# EAGLE design pc_healthypi_move_nRF5340_v3.0 (EAGLE 9.6.2)
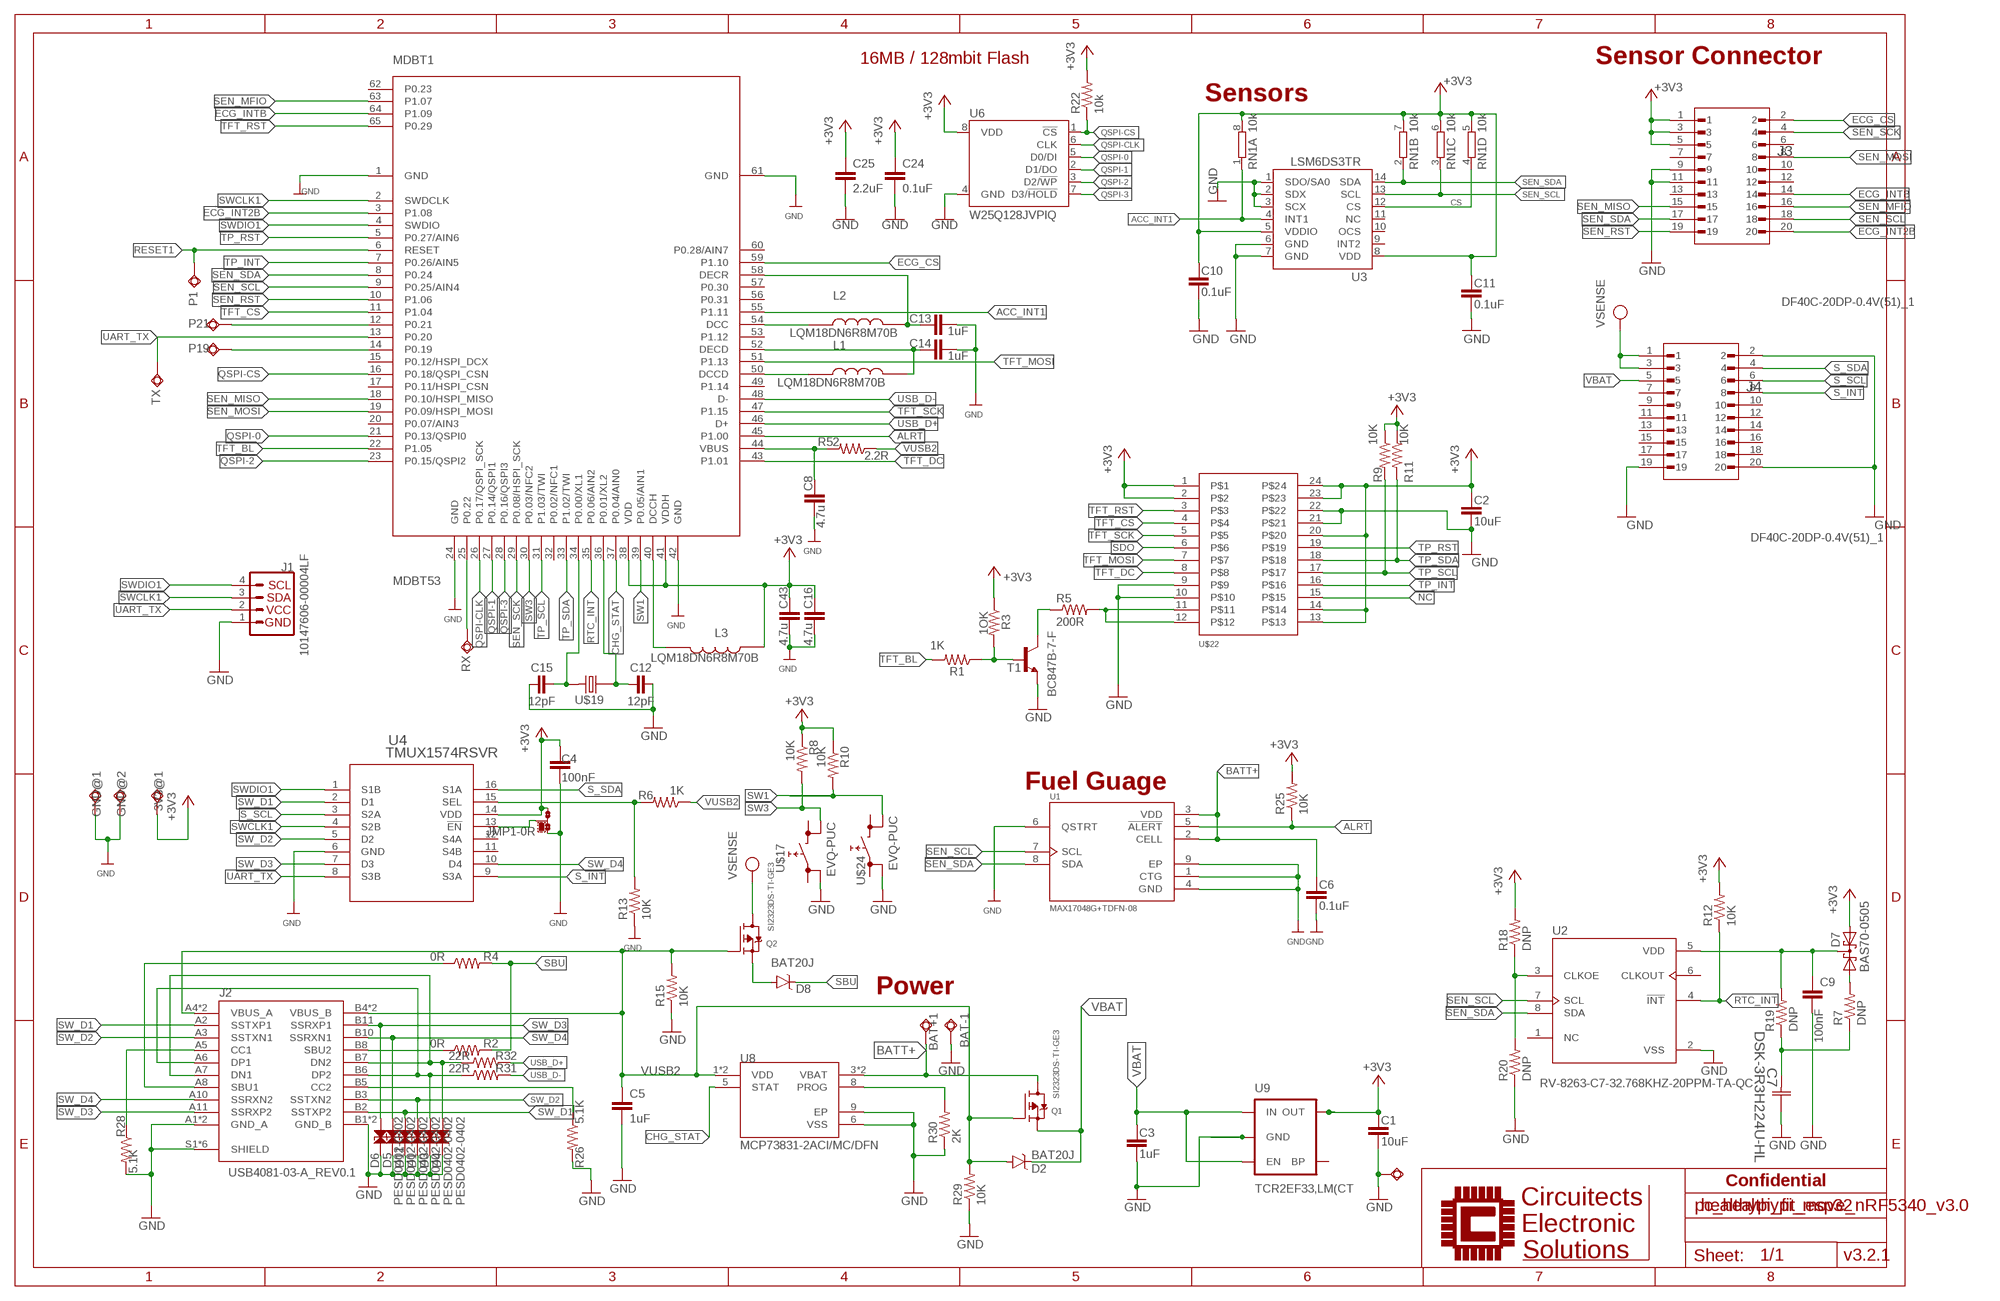
[diagram p0: schematic, sheet 1]

## Parts
3V3@1  TPSQTP13SQ  [TP13SQ]
BAT+1  TPSQTP13SQ  [TP13SQ]
BAT-1  TPSQTP13SQ  [TP13SQ]
C1  10uF  0.1UF-0603-100V-10%  [0603@1]
C2  10uF  0.1UF-0603-100V-10%  [0603@1]
C3  1uF  0.1UF-0402T-6.3V-10%-X7R  [0402-TIGHT]
C4  100nF  2.2UF-0402_TIGHT-10V-10%-X5R  [0402-TIGHT]
C5  1uF  2.2UF-0402_TIGHT-10V-10%-X5R  [0402-TIGHT]
C6  0.1uF  0.1UF-0402T-6.3V-10%-X7R  [0402-TIGHT]
C7  DSK-3R3H224U-HL  [CAP_DSK-3R3H224U-HL_ELN]
C8  4.7u  C-EUC0402  [C0402]
C9  100nF  C-EUC0402  [C0402]
C10  0.1uF  0.1UF-0402T-6.3V-10%-X7R  [0402-TIGHT]
C11  0.1uF  0.1UF-0402T-6.3V-10%-X7R  [0402-TIGHT]
C12  12pF  CAPACITORS-0402  [C0402]
C13  1uF  2.2UF-0402_TIGHT-10V-10%-X5R  [0402-TIGHT]
C14  1uF  2.2UF-0402_TIGHT-10V-10%-X5R  [0402-TIGHT]
C15  12pF  CAPACITORS-0402  [C0402]
C16  4.7u  C-EUC0402  [C0402]
C24  0.1uF  0.1UF-0402T-6.3V-10%-X7R  [0402-TIGHT]
C25  2.2uF  2.2UF-0402_TIGHT-10V-10%-X5R  [0402-TIGHT]
C43  4.7u  C-EUC0402  [C0402]
D1  PESD0402-0402  [0402]
D2  BAT20J  DIODE-SCHOTTKY-BAT20J  [SOD-323]
D3  PESD0402-0402  [0402]
D4  PESD0402-0402  [0402]
D5  PESD0402-0402  [0402]
D6  PESD0402-0402  [0402]
D7  BAS70-0505  [SOT23]
D8  BAT20J  DIODE-SCHOTTKY-BAT20J  [SOD-323]
D11  PESD0402-0402  [0402]
GND@1  TPSQTP13SQ  [TP13SQ]
GND@2  TPSQTP13SQ  [TP13SQ]
J1  10147606-00004LF  QWIIC_CONNECTORJS-1MM  [JST04_1MM_RA]
J2  USB4081-03-A_REV0.1  [GCT_USB4081-03-A_REV0.1]
J3  DF40C-20DP-0.4V(51)_1  [HRS_DF40C-20DP-0.4V(51)]
J4  DF40C-20DP-0.4V(51)_1  [HRS_DF40C-20DP-0.4V(51)]
JMP1  0R-JUMPB  [B0R-JMP]
L1  LQM18DN6R8M70B  [INDC1608X95N]
L2  LQM18DN6R8M70B  [INDC1608X95N]
L3  LQM18DN6R8M70B  [INDC1608X95N]
MDBT1  MDBT53  [MDBT53]
P1  TPSQTP13SQ  [TP13SQ]
P19  TPSQTP13SQ  [TP13SQ]
P21  TPSQTP13SQ  [TP13SQ]
Q1  SI2323DS-TI-GE3  MOSFET-P  [SOT23-R]
Q2  SI2323DS-TI-GE3  MOSFET-P  [SOT23-R]
R1  200  R-US_R0402  [R0402]
R2  0R  RESISTOR0402-RES  [0402-RES]
R3  200  R-US_R0402  [R0402]
R4  0R  RESISTOR0402-RES  [0402-RES]
R5  200R  R-US_R0402  [R0402]
R6  1K  RESISTOR0402-RES  [0402-RES]
R7  DNP  R-US_R0402  [R0402]
R8  10K  R-US_R0402  [R0402]
R9  10K  R-US_R0402  [R0402]
R10  10K  R-US_R0402  [R0402]
R11  10K  R-US_R0402  [R0402]
R12  10K  R-US_R0402  [R0402]
R13  10K  R-US_R0402  [R0402]
R15  10K  R-US_R0402  [R0402]
R18  DNP  R-US_R0402  [R0402]
R19  DNP  R-US_R0402  [R0402]
R20  DNP  R-US_R0402  [R0402]
R22  10k  R-US_R0402  [R0402]
R25  10K  RESISTOR0402-RES  [0402-RES]
R26  5.1K  RESISTOR0402-RES  [0402-RES]
R28  5.1K  RESISTOR0402-RES  [0402-RES]
R29  10K  R-US_R0402  [R0402]
R30  2K  R-US_R0402  [R0402]
R31  22R  RESISTOR0402-RES  [0402-RES]
R32  22R  RESISTOR0402-RES  [0402-RES]
R52  2.2R  RESISTOR0402-RES  [0402-RES]
RN1  10k  4R-N0402ARV341  [4X0402ARV341]
RX  TPSQTP13SQ  [TP13SQ]
SWIO6  TPSQTP11R  [TP11R]
T1  BC847B-7-F  MMBT2222ALT1-NPN-SOT23-BEC  [SOT23-BEC]
TX  TPSQTP13SQ  [TP13SQ]
U1  MAX17048G+TDFN-08  [SON50P200X200X80-9N]
U2  RV-8263-C7-32.768KHZ-20PPM-TA-QC  [IC_RV-8263-C7-32.768KHZ-20PPM-TA-QC]
U3  LSM6DS3TR  LSM6DS3  [LGA14L]
U4  TMUX1574RSVR  [RSV16_TEX]
U6  W25Q128JVPIQ  W25QXX128MBIT-6X5-SKINNY_CENTER  [WSON-8-6X5-SKINNY_CENTERPAD]
U8  MCP73831-2ACI/MC/DFN  [SON50P200X300X100-9N]
U9  TCR2EF33,LM(CT  V_REG_LDOSMD  [SOT23-5]
U$17  EVQ-PUC  [EVQ-PUC]
U$19  520-327-12.5-34B(32.768KHZ)  ECS-X-34B  [ECX-31B]
U$22  AXT524124  [AXT524124]
U$24  EVQ-PUC  [EVQ-PUC]

## Nets
+3V3: 3V3@1.TP C1.1 C2.1 C4.1 C10.1 C11.1 C16.1 C24.1 C25.1 C43.1 D7.2(A2) J3.1 J3.3 J3.5 JMP1.3 L3.1 MDBT1.38(VDD) MDBT1.41(VDDH) R3.1 R8.1 R9.1 R10.1 R11.1 R12.2 R18.2 R22.2 R25.2 RN1.5 RN1.6 RN1.7 RN1.8 U3.5(VDDIO) U3.8(VDD) U4.14(VDD) U6.8(VDD) U9.5(OUT) U$22.1 U$22.2 U$22.13 U$22.14 U$22.20 U$22.23 U$22.24
ACC_INT1: MDBT1.55(P1.11) RN1.1 U3.4(INT1)
ALRT: MDBT1.45(P1.00) R25.1 U1.5(!ALERT)
BATT+: BAT+1.TP C6.1 Q1.3(D) U1.2(CELL) U1.3(VDD) U8.3(VBAT) U8.4(VBAT)
CHG_STAT: MDBT1.37(P0.04/AIN0) U8.5(STAT)
CS: RN1.4 U3.12(CS)
ECG_CS: J3.2 MDBT1.59(P1.10)
ECG_INT2B: J3.20 MDBT1.3(P1.08)
ECG_INTB: J3.14 MDBT1.64(P1.09)
GND: BAT-1.TP C1.2 C2.2 C3.2 C4.2 C5.2 C6.2 C7.1 C8.2 C9.2 C10.2 C11.2 C12.2 C13.2 C14.2 C15.1 C16.2 C24.2 C25.2 C43.2 D1.1 D3.1 D4.1 D5.1 D6.1 D11.1 GND@1.TP GND@2.TP J1.1 J2.A1(GND_A) J2.A12(GND_A) J2.B1(GND_B) J2.B12(GND_B) J2.S1(SHIELD) J2.S2(SHIELD) J2.S3(SHIELD) J2.S4(SHIELD) J2.S5(SHIELD) J2.S6(SHIELD) J3.9 J3.11 J4.2 J4.19 J4.20 JMP1.1 MDBT1.1(GND) MDBT1.24(GND) MDBT1.42(GND) MDBT1.61(GND) R13.1 R15.1 R20.1 R26.2 R28.2 R29.1 R30.1 SWIO6.TP T1.E U1.1(CTG) U1.4(GND) U1.6(QSTRT) U1.9(EP) U2.2(VSS) U3.1(SDO/SA0) U3.2(SDX) U3.3(SCX) U3.6(GND) U3.7(GND) U4.6(GND) U6.4(GND) U8.6(VSS) U8.9(EP) U9.2(GND) U$17.3 U$22.9 U$22.10 U$22.21 U$22.22 U$24.3
N$1: J2.B8(SBU2) R2.1
N$2: J2.A8(SBU1) R4.1
N$4: J2.B5(CC2) R26.1
N$5: MDBT1.12(P0.21) P21.TP
N$6: J2.A5(CC1) R28.1
N$7: R30.2 U8.8(PROG)
N$8: D3.2 J2.A6(DP1) J2.B6(DP2) R31.1
N$9: D4.2 J2.A7(DN1) J2.B7(DN2) R32.1
N$18: R5.2 U$22.11 U$22.12
N$21: R5.1 T1.C
N$23: R1.1 R3.2 T1.B
N$25: C8.1 MDBT1.44(VBUS) R52.2
N$26: R6.2 R13.2 U4.15(SEL)
N$28: C15.2 MDBT1.34(P0.00/XL1) U$19.P$2
N$30: C9.1 D7.3(K1K2) R19.2 U2.5(VDD)
N$31: R18.1 R20.2 U2.3(CLKOE)
N$32: D7.1(A1) R7.2
N$33: C7.2 R7.1 R19.1
N$34: C12.1 MDBT1.36(P0.01/XL2) U$19.P$1
N$35: MDBT1.25(P0.22) RX.TP
N$36: L3.2 MDBT1.40(DCCH)
N$37: JMP1.2 U4.13(!EN)
N$38: L1.1 MDBT1.50(DCCD)
N$39: C14.1 L1.2 MDBT1.52(DECD)
N$40: L2.1 MDBT1.54(DCC)
N$41: C13.1 L2.2 MDBT1.58(DECR)
N$43: D8.A Q2.2(S)
NC: U$22.15
P19: MDBT1.14(P0.19) P19.TP
QSPI-0: MDBT1.21(P0.13/QSPI0) U6.5(D0/DI)
QSPI-1: MDBT1.27(P0.14/QSPI1) U6.2(D1/DO)
QSPI-2: MDBT1.23(P0.15/QSPI2) U6.3(D2/!WP!)
QSPI-3: MDBT1.28(P0.16/QSPI3) U6.7(D3/!HOLD!)
QSPI-CLK [Clock]: MDBT1.26(P0.17/QSPI_SCK) U6.6(CLK)
QSPI-CS: MDBT1.16(P0.18/QSPI_CSN) R22.1 U6.1(!CS!)
RESET1: MDBT1.6(RESET) P1.TP
RTC_INT: MDBT1.35(P0.06/AIN2) R12.1 U2.4(!INT)
S_INT: J4.8 U4.9(S3A)
S_SCL: J4.6 U4.3(S2A)
S_SDA: J4.4 U4.16(S1A)
SBU: D8.C R2.2 R4.2
SDO: U$22.6
SEN_MFIO: J3.16 MDBT1.63(P1.07)
SEN_MISO: J3.15 MDBT1.18(P0.10/HSPI_MISO)
SEN_MOSI: J3.8 MDBT1.19(P0.09/HSPI_MOSI)
SEN_RST: J3.19 MDBT1.10(P1.06)
SEN_SCK: J3.4 MDBT1.29(P0.08/HSPI_SCK)
SEN_SCL: J3.18 MDBT1.9(P0.25/AIN4) RN1.3 U1.7(SCL) U2.7(SCL) U3.13(SCL)
SEN_SDA: J3.17 MDBT1.8(P0.24) RN1.2 U1.8(SDA) U2.8(SDA) U3.14(SDA)
SW1: MDBT1.39(P0.05/AIN1) R10.2 U$24.2
SW3: MDBT1.30(P0.03/NFC2) R8.2 U$17.2
SW_D1: D11.2 J2.A2(SSTXP1) J2.B2(SSTXP2) U4.2(D1)
SW_D2: D1.2 J2.A3(SSTXN1) J2.B3(SSTXN2) U4.5(D2)
SW_D3: D6.2 J2.A11(SSRXP2) J2.B11(SSRXP1) U4.7(D3)
SW_D4: D5.2 J2.A10(SSRXN2) J2.B10(SSRXN1) U4.10(D4)
SWCLK1: J1.3 MDBT1.2(SWDCLK) U4.4(S2B)
SWDIO1: J1.4 MDBT1.4(SWDIO) U4.1(S1B)
TFT_BL: MDBT1.22(P1.05) R1.2
TFT_CS: MDBT1.11(P1.04) U$22.4
TFT_DC: MDBT1.43(P1.01) U$22.8
TFT_MOSI: MDBT1.51(P1.13) U$22.7
TFT_RST: MDBT1.65(P0.29) U$22.3
TFT_SCK: MDBT1.47(P1.15) U$22.5
TP_INT: MDBT1.7(P0.26/AIN5) U$22.16
TP_RST: MDBT1.5(P0.27/AIN6) U$22.19
TP_SCL: MDBT1.31(P1.03/TWI) R9.2 U$22.17
TP_SDA: MDBT1.33(P1.02/TWI) R11.2 U$22.18
UART_TX: J1.2 MDBT1.13(P0.20) TX.TP U4.8(S3B)
USB_D+: MDBT1.46(D+) R32.2
USB_D-: MDBT1.48(D-) R31.2
VBAT: C3.1 D2.C J4.5 Q1.2(S) U9.1(IN) U9.3(EN)
VPP: J4.1 J4.3 Q2.3(D) ; supply symbol labelled VSENSE
VUSB2: C5.1 D2.A J2.A4(VBUS_A) J2.A9(VBUS_A) J2.B4(VBUS_B) J2.B9(VBUS_B) Q1.1(G) Q2.1(G) R6.1 R15.2 R29.2 R52.1 U8.1(VDD) U8.2(VDD)
Unconnected: J3.6 J3.7 J3.10 J3.12 J3.13 J4.7 J4.9 J4.10 J4.11 J4.12 J4.13 J4.14 J4.15 J4.16 J4.17 J4.18 MDBT1.15(P0.12/HSPI_DCX) MDBT1.17(P0.11/HSPI_CSN) MDBT1.20(P0.07/AIN3) MDBT1.32(P0.02/NFC1) MDBT1.49(P1.14) MDBT1.53(P1.12) MDBT1.56(P0.31) MDBT1.57(P0.30) MDBT1.60(P0.28/AIN7) MDBT1.62(P0.23) U2.1(NC) U2.6(CLKOUT) U3.9(INT2) U3.10(OCS) U3.11(NC) U4.11(S4B) U4.12(S4A) U9.4(BP) U$17.1 U$17.4 U$24.1 U$24.4

## Notes on the sheet
- 16MB / 128mbit Flash
- Sensor Connector
- Sensors
- 1OK
- 1K
- Fuel Guage
- Power
- Confidential
- healthypi_fit_esp32
- v3.2.1

## Library data of the parts
3V3@1 BAT+1 BAT-1 GND@1 GND@2 P1 P19 P21 RX SWIO6 TX = testpad:TPSQ: Test pad
C1 C2 = SparkFun-Capacitors:0.1UF: 0.1µF ceramic capacitors A capacitor is a passive two-terminal electrical component used to store electrical energy temporarily in an electric field.; PROD_ID: CAP-08390; VALUE: 0.1uF
C3 = SparkFun-Capacitors:0.1UF: 0.1µF ceramic capacitors A capacitor is a passive two-terminal electrical component used to store electrical energy temporarily in an electric field.; PROD_ID: CAP-14993; VALUE: 0.1uF
C4 C5 C13 C14 = SparkFun-Capacitors:2.2UF: 2.2µF ceramic capacitors A capacitor is a passive two-terminal electrical component used to store electrical energy temporarily in an electric field.; PROD_ID: CAP-14232; VALUE: 2.2uF
C6 C10 C11 C24 = SparkFun-Capacitors:0.1UF: 0.1µF ceramic capacitors A capacitor is a passive two-terminal electrical component used to store electrical energy temporarily in an electric field.; PROD_ID: CAP-14993
C7 = circuitects:DSK-3R3H224U-HL; COPYRIGHT: Copyright (C) 2023 Ultra Librarian. All rights reserved.; MANUFACTURER_PART_NUMBER: DSK-3R3H224U-HL; MFR_NAME: Elna
C8 C9 C16 C43 = rcl:C-EU: CAPACITOR, European symbol; SPICEPREFIX: C
C12 C15 = Arduino:CAPACITORS: Capacitors ...4.7uF @ 6.3V -> 0402 ...10uF @ 16V -> 0603 ...22uF @ 25V -> 0805
C25 = SparkFun-Capacitors:2.2UF: 2.2µF ceramic capacitors A capacitor is a passive two-terminal electrical component used to store electrical energy temporarily in an electric field.; PROD_ID: CAP-14232
D1 D3-D6 D11 = SparkFun-DiscreteSemi:PESD0402: ESD protection diode PESD is used to protect a signal line from ESD.; DIGIKEY_PART: PESD0402-140CT-ND; MOUSE_PART: 650-PESD0402-140; PROD_ID: DIO-15359
D2 D8 = SparkFun-DiscreteSemi:DIODE-SCHOTTKY: Schottky diodes in SFE's production catalog BAT20J 1A 23V 0.62Vf RB751 120mA 40V 0.37Vf PMEG4005EJ 0.5A 40V 0.42Vf MBRA140 1A 40V 0.5Vf B340A 3A 40V SMA; PROD_ID: DIO-11623
D7 = circuitects:BAS70-05: General-purpose Schottky diodes General-purpose Schottky diodes in small Surface-Mounted Device (SMD) plastic packages AAL Eindhoven MK Check availability <https://pricing.snapeda.com/parts/BAS70-05/Diotec/view-part?ref=eda>; AVAILABILITY: In Stock; CHECK_PRICES: https://www.snapeda.com/parts/BAS70-05/Diotec/view-part/?ref=eda; DESCRIPTION: Schottky, SOT-23, 70V, 0.07A, 150C; MF: Diotec; MP: BAS70-05; PACKAGE: SOT-23-3 Diotec; PRICE: None; SNAPEDA_LINK: https://www.snapeda.com/parts/BAS70-05/Diotec/view-part/?ref=snap
J1 = SparkFun-Connectors:QWIIC_CONNECTOR: SparkFun I2C Standard Qwiic Connector An SMD 1mm pitch JST connector makes it easy and quick (get it? Qwiic?) to connect I2C devices to each other. The Qwiic system <http://www.sparkfun.com/qwiic> enables fast and solderless connection between popular platforms and various sensors and actuators. We carry 200mm <https://www.sparkfun.com/products/14204>, 100mm <https://www.sparkfun.com/products/14205>, 50mm <https://www.sparkfun.com/products/14206>, and breadboard friendly <https://www.sparkfun.com/products/14207> Qwiic cables. We also offer 10 pcs strips <https://www.sparkfun.com/products/14323> the SMD connectors.; PROD_ID: CONN-13694; VALUE: QWIIC_RIGHT_ANGLE
J2 = circuitects:USB4081-03-A_REV0.1: Check availability <https://pricing.snapeda.com/parts/USB4081-03-A/Global%20Connector%20Technology/view-part?ref=eda>; AVAILABILITY: In Stock; DESCRIPTION: Type C USB 3.2 Gen 2 Connector; MF: Global Connector Technology; MP: USB4081-03-A; PACKAGE: None; PRICE: None
J3 J4 = circuitects:DF40C-20DP-0.4V(51)_1; MANUFACTURER: Hirose Electric; MAXIMUM_PACKAGE_HEIGHT: 1.29mm; PARTREV: 02/2020; STANDARD: Manufacturer Recommendations
JMP1 = jump-0r-smd:0R-JUMP: SMD 0R 0805 Jumper
L1-L3 = circuitects:LQM18DN6R8M70B: Inductor with Inductance 6.8uH Tol.+/-20% Package 0603 (1608) Check availability <https://pricing.snapeda.com/parts/LQM18DN6R8M70B/Murata/view-part?ref=eda>; AVAILABILITY: In Stock; CHECK_PRICES: https://www.snapeda.com/parts/LQM18DN6R8M70B/Murata/view-part/?ref=eda; DESCRIPTION: Inductor with Inductance 6.8uH Tol.+/-20% Package 0603 (1608); MF: Murata; MP: LQM18DN6R8M70B; PACKAGE: 0603 Murata; PRICE: None; SNAPEDA_LINK: https://www.snapeda.com/parts/LQM18DN6R8M70B/Murata/view-part/?ref=snap
MDBT1 = circuitects:MDBT53: Raytac Corporation Part Number: MDBT53-1M / MDBT53-P1M / MDBT53-U1M Bluetooth Low Energy Module based on Noridc nRF5340 Size: 14.3x9.3mm Source: Raytac datasheet
Q1 Q2 = microbuilder:MOSFET-P: P-Channel Mosfet SOT-23 IRLML5103 30V 760mA 1V Vgs - Digikey: IRLML5103PBFCT-ND NTR0202PL 20V 400mA 2.3V Vgs - Digikey: NTR0202PLT1GOSTR-ND NTR4101PT1G 20V 1.8A 1.2V Vgs - Digikey: NTR4101PT1GOSCT-ND DMP2004K 20V 600mA 1V Vgs - Digikey: DMP2004KDICT-ND
R1 R3 R5 R7-R13 R15 R18-R20 R22 R29 R30 = rcl:R-US_: RESISTOR, American symbol; SPICEPREFIX: R
R2 R4 R6 R25 R26 R28 R31 R32 R52 = SparkFun:RESISTOR: Resistor Basic schematic elements and footprints for 0603, 1206, and PTH resistors.
RN1 = resistor-dil:4R-N: Array Chip Resistor Source: RS Component / Phycomp; OC_FARNELL: unknown; OC_NEWARK: unknown
T1 = transistor:*-NPN-: NPN Transistror BF959 corrected 2008.03.06
U1 = circuitects:MAX17048G+: Micropower 1-Cell/2-Cell Li+ ModelGauge ICs Check availability <https://pricing.snapeda.com/parts/MAX17048G%2B/Analog%20Devices/view-part?ref=eda>; AVAILABILITY: In Stock; DESCRIPTION: 3µA 1-Cell/2-Cell Fuel Gauge with ModelGauge; MF: Analog Devices; MP: MAX17048G+; PACKAGE: TDFN-8 Maxim; PRICE: None; PURCHASE-URL: https://pricing.snapeda.com/search/part/MAX17048G+/?ref=eda
U2 = circuitects:RV-8263-C7-32.768KHZ-20PPM-TA-QC: Check availability <https://pricing.snapeda.com/parts/RV-8263-C7-32.768KHZ-20PPM-TA-QC/Micro%20Crystal/view-part?ref=eda>; AVAILABILITY: In Stock; CHECK_PRICES: https://www.snapeda.com/parts/RV-8263-C7-32.768KHZ-20PPM-TA-QC/Micro+Crystal/view-part/?ref=eda; DESCRIPTION: Real-Time Clock Module in 1.5 x 3.2 mm package; MF: Micro Crystal; MP: RV-8263-C7-32.768KHZ-20PPM-TA-QC; PACKAGE: QFN-8 Micro Crystal; PRICE: None; SNAPEDA_LINK: https://www.snapeda.com/parts/RV-8263-C7-32.768KHZ-20PPM-TA-QC/Micro+Crystal/view-part/?ref=snap
U3 = LSM6DS3:LSM6DS3
U4 = circuitects:TMUX1574RSVR; COPYRIGHT: Copyright (C) 2024 Ultra Librarian. All rights reserved.; MANUFACTURER_PART_NUMBER: TMUX1574RSVR; MFR_NAME: Texas Instruments
U6 = SparkFun-IC-Memory:W25QXX; PROD_ID: IC-15107
U8 = circuitects:MCP73831-2ACI/MC/DFN: MCP73831 Series Single-Cell Li-Ion/Li-Polymer Battery Charge Controller - DFN-8 Check availability <https://pricing.snapeda.com/parts/MCP73831-2ACI/MC/Microchip%20Technology/view-part?ref=eda>; AVAILABILITY: In Stock; DESCRIPTION: Linear Battery Charger Controller Li-Ion/Li-Pol 505mA 4.2V 8-Pin DFN EP Tube; MF: Microchip Technology; MP: MCP73831-2ACI/MC; PACKAGE: None; PRICE: None; PURCHASE-URL: https://pricing.snapeda.com/search/part/MCP73831-2ACI/MC/?ref=eda
U9 = SparkFun-PowerIC:V_REG_LDO: Voltage Regulator LDO Standard 150mA LDO voltage regulator in SOT-23 layout. Micrel part MIC5205. BP (by-pass) pin is used to lower output noise with 470pF cap.; PROD_ID: VREG-12457
U$17 U$24 = circuitects:EVQ-PUC
U$19 = circuitects:ECS-X-34B
U$22 = circuitects:AXT524124: Panasonic AXT524124 connector for LI-LBCM3M1 3MP camera module

## Net classes
2 Clock: width 0.089 mm, clearance 0.178 mm

## Board
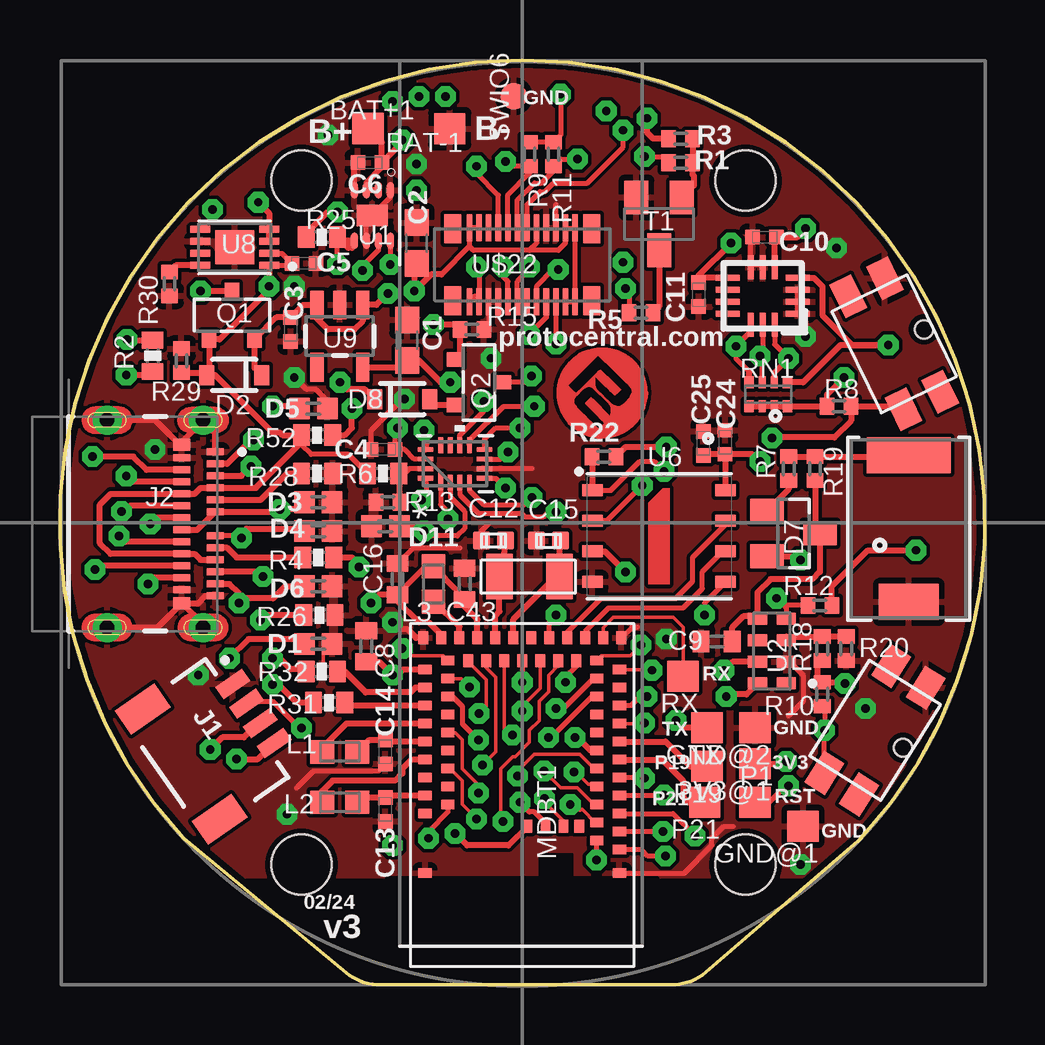
[diagram p1: board, top side]
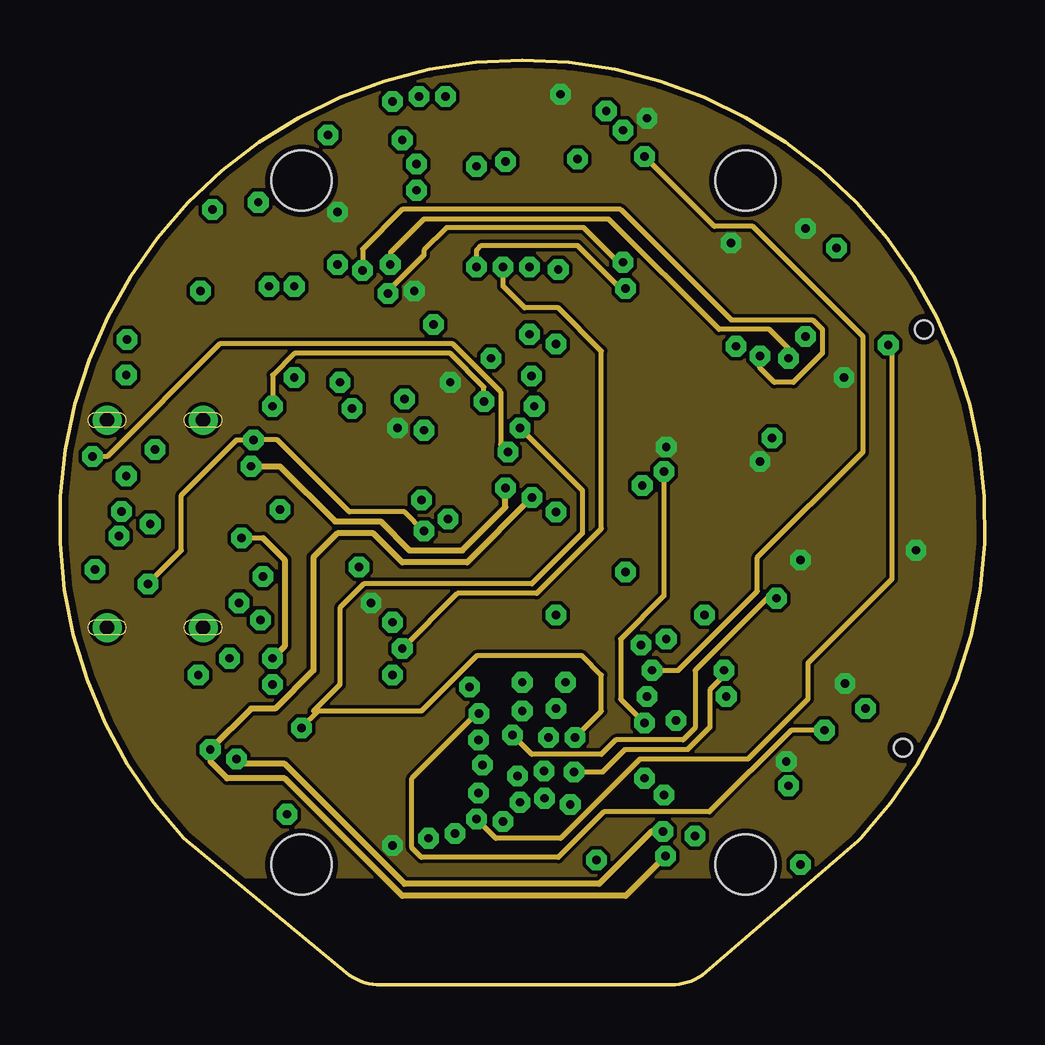
[diagram p2: board, inner layer Route2]
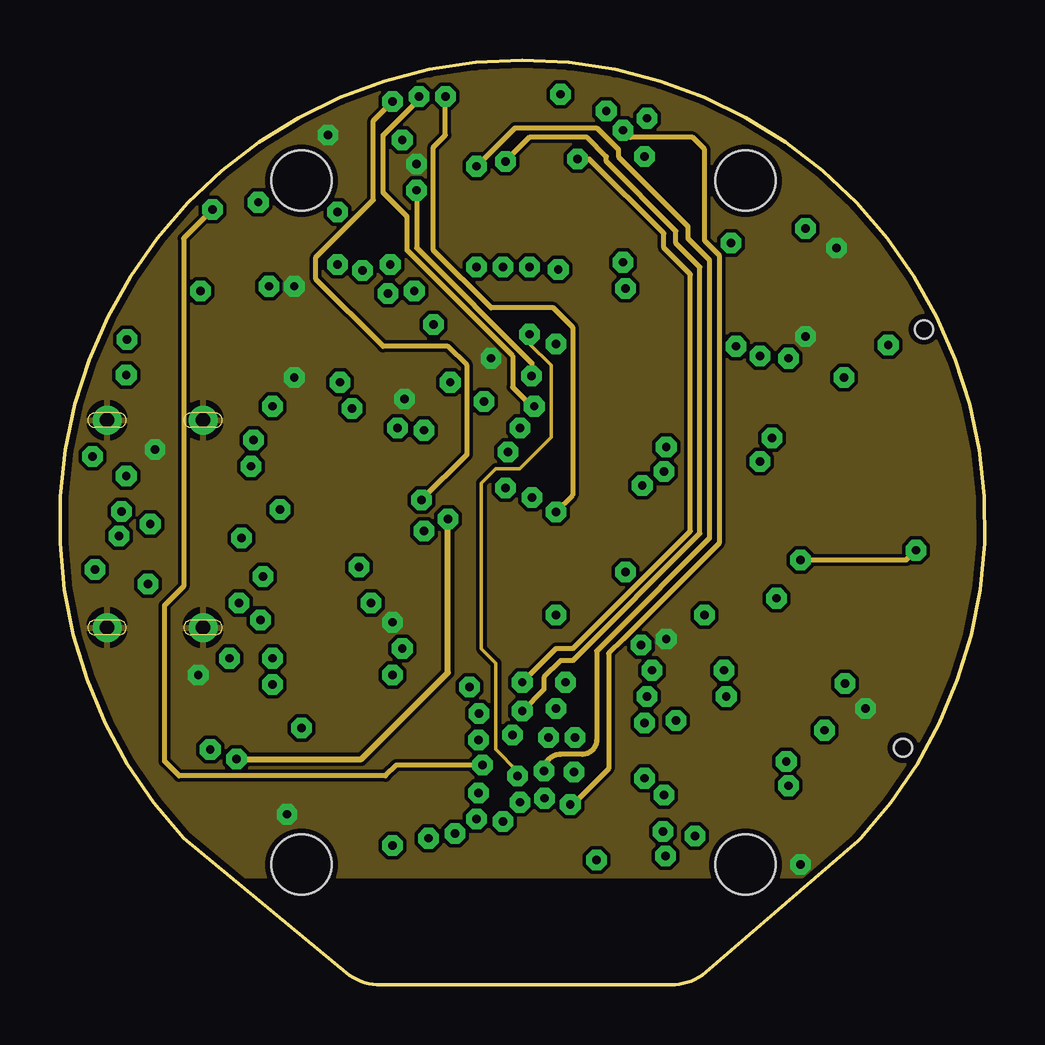
[diagram p3: board, inner layer Route15]
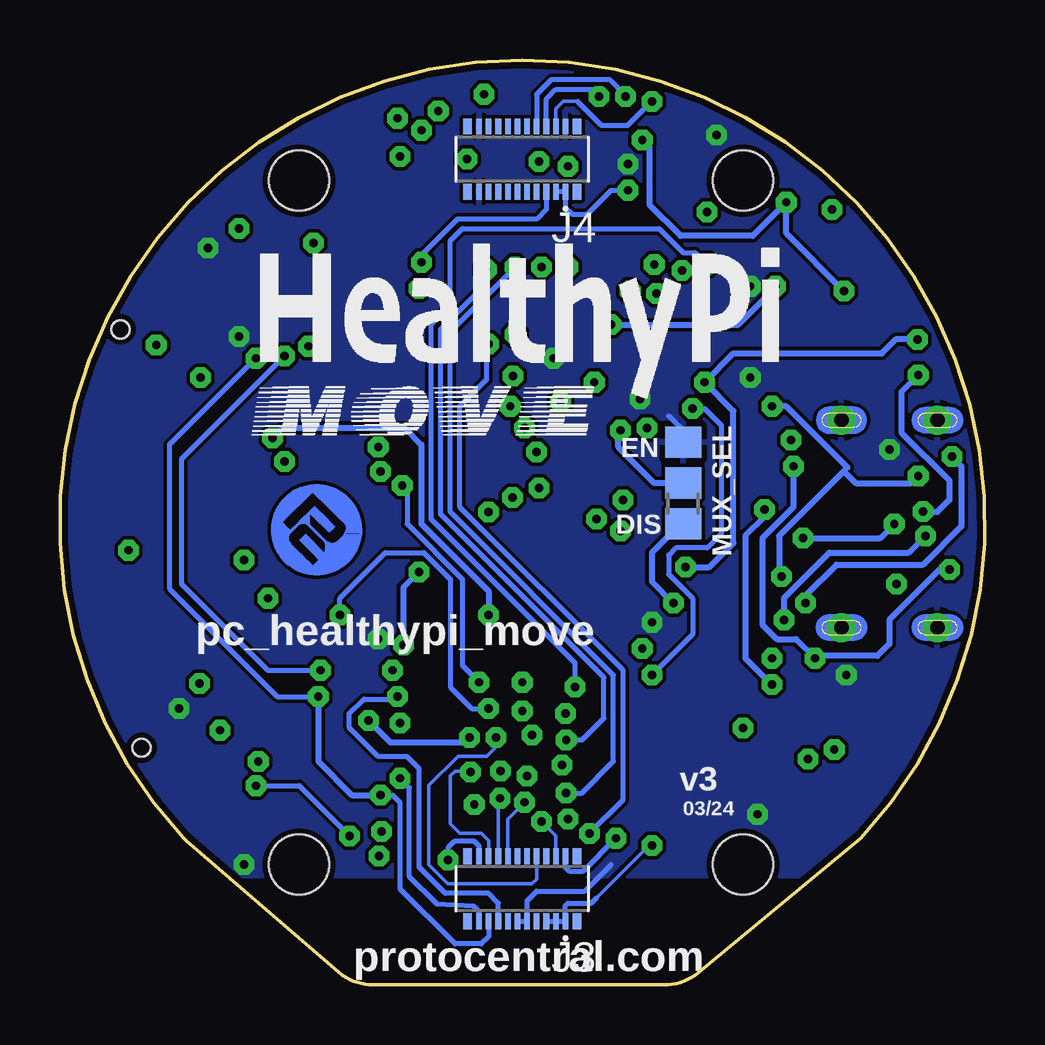
[diagram p4: board, bottom side, seen from below]

Size 38.52 x 38.54 mm. Coordinates in mm from the lower left corner, seen from the top.
Outline: 13.56,0.01 25.46,0.01 arc37 26.76,0.41 33.26,6.01 33.36,6.11 arc266 5.16,6.11 12.06,0.41 arc42 13.56,0.01
Copper layers (1*2*15*16): Top 0.035mm / dielectric 0.26mm / Route2 0.035mm / dielectric 0.2mm / Route15 0.035mm / dielectric 0.2mm / Bottom 0.035mm
Design rules "Circuitects-Rules *": minimum track width 6mil, minimum drill 0.3mm, track to track 6mil, track to pad 6mil, pad to pad 6mil, via to via 6mil, smd to smd 6mil, copper to edge 10mil, drill to drill 8mil, minimum pad ring 12mil, minimum via ring 10mil, stop-mask expansion 4mil, vias tented up to drill 25mil, thermal gap 10mil
Holes 2.5 mm at 10.06,33.51 28.56,33.51 10.06,5.01 28.56,5.01

### Footprints (pad centres in the part's own frame; a part is rotated, then mirrored left to right if it is on the bottom)
TP13SQ = smd 1.3 x 1.3: TP 0,0
0603@1 = smd 1.1 x 1: 1 -0.85,0; 2 0.85,0
0402-TIGHT = smd 0.6 x 0.6: 1 -0.5,0; 2 0.5,0
CAP_DSK-3R3H224U-HL_ELN = smd 2.489 x 1.499: 1 0,3.05 | smd 3.505 x 1.499: 2 0,-3.05
C0402 = smd 0.7 x 0.9: 1 -0.65,0; 2 0.65,0
C0402' = smd 0.75 x 0.7: 1 0,0.5; 2 0,-0.5
0402 = smd 0.85 x 0.9: 1 -0.58,0; 2 0.58,0
SOD-323 = smd 0.63 x 0.83: A 1.15,0; C -1.15,0
SOT23 = smd 1 x 1.4: 1 -0.95,-1.1; 2 0.95,-1.1; 3 0,1.1
JST04_1MM_RA = smd 0.6 x 1.35: 1 -1.5,0; 2 -0.5,0; 3 0.5,0; 4 1.5,0 | smd 1.2 x 2: NC1 2.8,-3.675; NC2 -2.8,-3.675
GCT_USB4081-03-A_REV0.1 = smd 0.3 x 0.7: A1 -3,0.51; A2 -2.5,0.51; A3 -2,0.51; A4 -1.5,0.51; A5 -1,0.51; A6 -0.5,0.51; A7 0.5,0.51; A8 1,0.51; A9 1.5,0.51; A10 2,0.51; A11 2.5,0.51; A12 3,0.51; B1 2.75,-0.89; B2 2.25,-0.89; B3 1.75,-0.89; B4 1.25,-0.89; B5 0.75,-0.89; B6 0.25,-0.89; B7 -0.25,-0.89; B8 -0.75,-0.89; B9 -1.25,-0.89; B10 -1.75,-0.89; B11 -2.25,-0.89; B12 -2.75,-0.89 | drill 0.6 pad 1.1: S1 -4.32,-4; S2 4.32,-4; S3 -4.32,0; S4 4.32,0 | smd 0.5 x 0.7: S5 -3.3,-0.89; S6 3.3,-0.89
HRS_DF40C-20DP-0.4V(51) = smd 0.23 x 0.66: 1 -1.8,1.355; 2 -1.8,-1.355; 3 -1.4,1.355; 4 -1.4,-1.355; 5 -1,1.355; 6 -1,-1.355; 7 -0.6,1.355; 8 -0.6,-1.355; 9 -0.2,1.355; 10 -0.2,-1.355; 11 0.2,1.355; 12 0.2,-1.355; 13 0.6,1.355; 14 0.6,-1.355; 15 1,1.355; 16 1,-1.355; 17 1.4,1.355; 18 1.4,-1.355; 19 1.8,1.355; 20 1.8,-1.355 | smd 0.35 x 0.66: S1 -2.275,1.355; S2 -2.275,-1.355; S3 2.275,1.355; S4 2.275,-1.355
B0R-JMP = smd 1.5 x 1.3: 1 0,1.7; 2 0,0; 3 0,-1.7
INDC1608X95N = smd 1 x 0.97: 1 -0.735,0; 2 0.735,0
MDBT53 = smd 0.55 x 0.4: 1 -4.05,3.25; 2 -4.05,2.275; 3 -3.1,1.9; 4 -4.05,1.525; 5 -3.1,1.15; 6 -4.05,0.775; 7 -3.1,0.4; 8 -4.05,0.025; 9 -3.1,-0.35; 10 -4.05,-0.725; 11 -3.1,-1.1; 12 -4.05,-1.475; 13 -3.1,-1.85; 14 -4.05,-2.225; 15 -3.1,-2.6; 16 -4.05,-2.975; 17 -3.1,-3.35; 18 -4.05,-3.725; 19 -3.1,-4.1; 20 -4.05,-4.475; 21 -3.1,-4.85; 22 -4.05,-5.225; 23 -3.1,-5.6; 43 3.1,-5.6; 44 4.05,-5.225; 45 3.1,-4.85; 46 4.05,-4.475; 47 3.1,-4.1; 48 4.05,-3.725; 49 3.1,-3.35; 50 4.05,-2.975; 51 3.1,-2.6; 52 4.05,-2.225; 53 3.1,-1.85; 54 4.05,-1.475; 55 3.1,-1.1; 56 4.05,-0.725; 57 3.1,-0.35; 58 4.05,0.025; 59 3.1,0.4; 60 4.05,0.775; 61 4.05,3.25 | smd 0.4 x 0.55: 24 -4.125,-6.55; 25 -3.375,-6.55; 26 -2.625,-6.55; 27 -2.25,-5.6; 28 -1.875,-6.55; 29 -1.5,-5.6; 30 -1.125,-6.55; 31 -0.75,-5.6; 32 -0.375,-6.55; 33 0,-5.6; 34 0.375,-6.55; 35 0.75,-5.6; 36 1.125,-6.55; 37 1.5,-5.6; 38 1.875,-6.55; 39 2.25,-5.6; 40 2.625,-6.55; 41 3.375,-6.55; 42 4.125,-6.55; 62 -2.375,1.3; 63 -1.725,1.3; 64 -0.975,1.3; 65 -0.225,1.3
SOT23-R = smd 0.6 x 0.7: 1 -0.95,-1; 2 0.95,-1; 3 0,1
R0402 = smd 0.6 x 0.7: 1 -0.5,0; 2 0.5,0
0402-RES = smd 0.7 x 0.9: 1 -0.65,0; 2 0.65,0
4X0402ARV341 = smd 0.4 x 0.5: 1 -0.8,-0.5; 4 0.8,-0.5; 5 0.8,0.5; 8 -0.8,0.5 | smd 0.3 x 0.5: 2 -0.25,-0.5; 3 0.25,-0.5; 6 0.25,0.5; 7 -0.25,0.5
TP11R = smd 1.1 x 1.1: TP 0,0
SOT23-BEC = smd 1 x 1.4: B -0.95,-1.1; C 0,1.1; E 0.95,-1.1
SON50P200X200X80-9N = smd 0.7 x 0.3: 1 -1.05,0.75; 2 -1.05,0.25; 3 -1.05,-0.25; 4 -1.05,-0.75; 5 1.05,-0.75; 6 1.05,-0.25; 7 1.05,0.25; 8 1.05,0.75 | smd 0.9 x 1.3: 9 0,0
IC_RV-8263-C7-32.768KHZ-20PPM-TA-QC = smd 0.8 x 0.5: 1 -0.6,1.35; 2 -0.6,0.45; 3 -0.6,-0.45; 4 -0.6,-1.35; 5 0.6,-1.35; 6 0.6,-0.45; 7 0.6,0.45; 8 0.6,1.35
LGA14L = smd 1 x 0.25: 1 -1.45,0.75; 2 -1.45,0.25; 3 -1.45,-0.25; 4 -1.45,-0.75; 8 1.45,-0.75; 9 1.45,-0.25; 10 1.45,0.25; 11 1.45,0.75 | smd 0.25 x 1: 5 -0.5,-1.2; 6 0,-1.2; 7 0.5,-1.2; 12 0.5,1.2; 13 0,1.2; 14 -0.5,1.2
RSV16_TEX = smd 0.75 x 0.2: 1 -0.724,0.6 | smd 0.65 x 0.2: 2 -0.775,0.2; 3 -0.775,-0.2; 4 -0.775,-0.6; 9 0.775,-0.6; 10 0.775,-0.2; 11 0.775,0.2; 12 0.775,0.6 | smd 0.2 x 0.65: 5 -0.6,-1.23; 6 -0.2,-1.23; 7 0.2,-1.23; 8 0.6,-1.23; 13 0.6,1.23; 14 0.2,1.23; 15 -0.2,1.23; 16 -0.6,1.23
WSON-8-6X5-SKINNY_CENTERPAD = smd 0.85 x 0.5: 1 -2.775,1.905; 2 -2.775,0.635; 3 -2.775,-0.635; 4 -2.775,-1.905; 5 2.775,-1.905; 6 2.775,-0.635; 7 2.775,0.635; 8 2.775,1.905
SON50P200X300X100-9N = smd 0.84 x 0.27: 1 -1.435,0.75; 2 -1.435,0.25; 3 -1.435,-0.25; 4 -1.435,-0.75; 5 1.435,-0.75; 6 1.435,-0.25; 7 1.435,0.25; 8 1.435,0.75 | smd 1.625 x 1.425: 9 0,0
SOT23-5 = smd 0.55 x 1.2: 1 -0.95,-1.3; 2 0,-1.3; 3 0.95,-1.3; 4 0.95,1.3; 5 -0.95,1.3
EVQ-PUC = smd 1.55 x 1: 1 2.625,0.85; 2 2.625,-0.85; 3 -2.625,0.85; 4 -2.625,-0.85 | hole 0.75: 0,1.375
ECX-31B = smd 1.1 x 1.9: P$1 1.25,0; P$2 -1.25,0
AXT524124 = smd 0.23 x 1.12: 1 2.2,-1.54; 2 1.8,-1.54; 3 1.4,-1.54; 4 1,-1.54; 5 0.6,-1.54; 6 0.2,-1.54; 7 -0.2,-1.54; 8 -0.6,-1.54; 9 -1,-1.54; 10 -1.4,-1.54; 11 -1.8,-1.54; 12 -2.2,-1.54; 13 -2.2,1.54; 14 -1.8,1.54; 15 -1.4,1.54; 16 -1,1.54; 17 -0.6,1.54; 18 -0.2,1.54; 19 0.2,1.54; 20 0.6,1.54; 21 1,1.54; 22 1.4,1.54; 23 1.8,1.54; 24 2.2,1.54 | smd 0.7 x 1.2: M1 -2.9,-1.5; M12 2.9,-1.5; M13 2.9,1.5; M24 -2.9,1.5

### Placement (x,y rotation side)
3V3@1  28.96,9.21 180 top
BAT+1  12.83,35.68 180 top
BAT-1  16.24,35.67 180 top
C1  14.46,26.86 90 top
C2  14.86,30.91 90 top
C3  9.61,27.31 270 top
C4  13.46,22.31 180 top
C5  10.16,30.06 0 top
C6  12.91,34.26 180 top
C7  35.36,19.01 180 top
C8  12.76,14.11 90 top
C9  27.36,14.31 180 top
C10  29.36,31.16 180 top
C11  26.61,28.76 270 top
C12  12pF  [C0402']  18.06,18.51 270 top
C13  13.56,7.31 270 top
C14  13.56,9.71 270 top
C15  12pF  [C0402']  20.36,18.51 90 top
C16  14.06,16.91 90 top
C24  27.71,22.61 90 top
C25  26.81,22.56 90 top
C43  16.86,16.71 90 top
D1  10.76,14.21 180 top
D2  7.26,25.41 180 top
D3  10.76,20.11 180 top
D4  10.76,18.91 180 top
D5  10.56,24.01 180 top
D6  10.76,16.61 180 top
D7  30.56,18.81 270 top
D8  14.26,24.41 0 top
D11  13.56,19.11 0 top
GND@1  30.96,6.61 180 top
GND@2  28.96,10.71 180 top
J1  8.06,11.31 305 top
J2  5.96,19.21 270 top
J3  19.26,4.01 180 bottom
J4  19.26,34.41 180 bottom
JMP1  12.56,20.91 0 bottom
L1  11.66,9.71 0 top
L2  11.66,7.61 0 top
L3  15.56,16.71 270 top
MDBT1  19.26,7.91 180 top
P1  28.96,7.61 0 top
P19  26.96,9.11 180 top
P21  26.86,7.61 180 top
Q1  7.16,27.9 0 top
Q2  17.46,25.11 270 top
R1  25.86,34.26 180 top
R2  3.86,26.21 90 top
R3  25.86,35.26 0 top
R4  10.76,17.81 0 top
R5  24.21,28.01 180 top
R6  13.46,21.31 0 top
R7  30.36,21.51 270 top
R8  32.46,24.11 0 top
R9  19.56,34.61 270 top
R10  31.76,12.11 270 top
R11  20.56,34.61 270 top
R12  31.66,15.81 0 top
R13  13.66,20.11 0 top
R15  17.16,27.31 180 top
R18  31.76,14.01 270 top
R19  31.46,21.51 270 top
R20  32.76,14.01 90 top
R22  22.66,22.01 0 top
R25  10.91,31.16 180 top
R26  10.81,15.41 0 top
R28  10.71,21.31 0 top
R29  5.06,26.01 270 top
R30  4.56,29.21 90 top
R31  11.21,11.76 0 top
R32  10.91,13.06 0 top
R52  10.71,22.91 0 top
RN1  29.51,24.61 180 top
RX  25.96,12.86 180 top
SWIO6  18.91,37.03 180 top
T1  24.96,31.71 180 top
TX  26.96,10.71 180 top
U1  13.01,32.06 270 top
U2  29.66,13.91 180 top
U3  29.28,28.71 180 top
U4  16.46,21.71 90 top
U6  24.96,18.7 0 top
U8  7.28,30.73 180 top
U9  11.66,27.03 180 top
U$1  [PCROUNDLOGO_GOLD]  19.76,22.41 0 top
U$6  [HEALTHYPI_MOVE_LOGO_1]  31.36,20.31 0 bottom
U$10  [PCROUNDLOGO_GOLD]  30.66,16.71 0 bottom
U$13  [HEALTHYPI_MOVE_LOGO]  30.16,21.11 0 bottom
U$17  34.76,26.71 296 top
U$19  19.56,17.01 180 top
U$22  19.26,30.01 0 top
U$24  33.96,10.61 238 top

### Tracks (layer width: path | path; a pad name or v marks a point on that pad's centre or on a via)
+3V3  (via drill 0.35)
  Top 0.2: U4.14 14.76,21.91 14.36,22.31 C4.1 13.96,23.01 14.06,23.11 v14.06,23.21 | R9.1 19.61,35.16 19.66,35.11 R11.1 20.86,35.41 v20.86,37.11 | C16.1 15.25,17.45 L3.1 16.06,16.95 16.06,16.91 | U$22.14 U$22.13 17.06,30.77 | U$22.2 U$22.1 21.46,31.47 21.42,31.51 | 17.06,30.77 15.9,29.61 | U$22.20 19.86,30.91 19.56,30.61 | U$22.23 21.06,31.51 | 21.06,31.51 21.06,30.91 20.76,30.61 19.56,30.61 | U$22.24 21.42,31.51 | 21.42,31.51 21.06,31.51 | 19.56,30.61 17.22,30.61 17.06,30.77
  Top 0.254: MDBT1.38 17.39,15.24 16.86,15.76 C43.1 | MDBT1.41 15.89,14.59 15.36,15.11 14.96,15.11 14.06,16.01 C16.1 13.31,16.26 v12.96,15.91 | U9.5 14.18,25.73 C1.1 14.96,26.01 15.86,25.11 v16.26,25.11 | U3.8 26.81,29.46 C11.1 26.61,29.56 v27.96,30.91 | U3.5 29.78,31.08 C10.1 30.71,31.16 v31.06,31.51 | U6.8 27.74,22.09 C24.1 | C25.1 26.86,22.11 C24.1 | R18.2 31.56,13.31 31.56,12.81 R10.1 32.46,12.61 32.56,12.71 v32.71,12.56 | 3V3@1.TP 30.16,9.21 v30.26,9.31 | R12.2 32.16,16.61 33.66,18.11 v35.66,18.11 | D7.2 30.71,17.86 v30.86,17.71 | RN1.5 RN1.6 RN1.7 RN1.8 R8.1 31.96,24.61 v32.66,25.31 | v25.26,22.41 23.56,22.41 R22.2 | v29.16,21.81 28.86,22.11 C24.1 | R3.1 24.71,35.26 24.46,35.51 v24.46,36.11 | 15.9,29.61 15.46,29.61 v14.76,28.91 14.76,29.96 C2.1 | R25.2 10.26,31.31 11.16,32.21 v11.56,32.21 | C43.1 16.86,16.11 16.06,16.91 | C43.1 16.86,16.1
  Route15 0.2: v30.86,17.71 35.26,17.71 v35.66,18.11
  Bottom 0.152: 16.16,3.63 13.98,5.81 v13.86,5.81
  Bottom 0.2: J3.5 J3.3 J3.1 17.46,3.31 17.36,3.41 16.38,3.41 16.16,3.63
  Bottom 0.254: JMP1.3 12.66,19.21 13.86,18.01 13.86,16.81 v12.96,15.91
  pour Route2: 39.06,4.51 0.06,4.51 0.06,39.01 39.06,39.01
ACC_INT1  (via drill 0.35)
  Top 0.152: v17.36,6.92 16.76,7.52 16.76,8.51 16.26,9.01
  Top 0.2: MDBT1.55 16.26,9.01
  Top 0.254: U3.4 31.41,29.46 31.76,29.11 31.76,27.91 33.01,26.66 v34.51,26.66 32.51,26.66 30.96,25.11 RN1.1
  Route2 0.2: v34.51,26.66 34.66,26.51 34.66,16.91 31.16,13.41 31.16,11.91 28.66,9.41 24.16,9.41 20.86,6.11 18.16,6.11 17.56,6.71 17.56,6.72 v17.36,6.92
ALRT  (via drill 0.35)
  Top 0.152: MDBT1.45 16.71,12.76 v17.06,12.41
  Top 0.2: v11.56,30.01 R25.1 | 12.16,30.71 11.86,31.01
  Top 0.254: U1.5 11.86,31.01 | 12.16,30.71 12.01,30.71 R25.1
  Bottom 0.2: v17.06,12.41 17.06,13.41 23.06,19.41 23.06,27.51 22.26,28.31 22.26,31.01 21.76,31.51 13.56,31.51 12.56,30.51 12.06,30.51 v11.56,30.01
BATT+  (via drill 0.35)
  Top 0.254: U8.3 U8.4 8.72,32.16 v8.26,32.61 | U1.2 U1.3 12.76,33.41 13.41,34.06 C6.1 | C6.1 13.41,35.1 BAT+1.TP | Q1.3 v5.87,28.9 v5.86,28.91 | v14.26,35.21 14.26,35.11 C6.1
  Bottom 0.254: v5.86,28.91 8.26,31.31 v8.26,32.61 9.66,31.21 12.66,31.21 13.96,32.51 13.96,34.91 v14.26,35.21
CHG_STAT  (via drill 0.35)
  Top 0.152: MDBT1.37 17.76,13.21 18.16,12.81 18.16,9.71 v17.61,9.16
  Top 0.2: MDBT1.37 17.76,13.31 | v6.36,32.31 6.36,32 U8.5
  Route15 0.2: v17.61,9.16 14.01,9.16 13.56,8.71 4.96,8.71 4.36,9.31 4.36,15.81 5.15,16.6
  Route15 0.203: 5.15,16.6 5.15,31.1 v6.36,32.31
CS  (via drill 0.35)
  Top 0.2: U3.12 28.78,27.23 v28.16,26.61 28.16,26.1 28.73,25.53
  Top 0.254: RN1.4 28.71,25.51 28.73,25.53
ECG_CS  (via drill 0.35)
  Top 0.2: v15.36,6.11 15.36,6.41 16.16,7.21 MDBT1.59
  Bottom 0.2: v15.36,6.11 16.75,4.73 17.28,4.73 17.46,4.91 J3.2
ECG_INT2B  (via drill 0.35)
  Top 0.2: v22.36,5.21 MDBT1.3
  Bottom 0.2: J3.20 21.06,5.78 21.26,5.98 22.09,5.98 22.36,5.71 v22.36,5.21
ECG_INTB  (via drill 0.35)
  Top 0.2: v19.16,7.61 19.56,7.21 19.76,7.21 20.24,6.74 MDBT1.64
  Bottom 0.152: J3.14 19.86,6.91 v19.16,7.61
GND  (via drill 0.35)
  Top 0.152: D1.1 10.96,13.83 10.96,13.41
  Top 0.2: U2.2 30.41,13.46 30.96,12.91 30.96,11.81 30.36,11.21 | 19.66,21.51 U4.6 | U1.6 12.76,31.81 U1.9 13.76,32.81 U1.1 | U3.7 28.78,30.01 | 28.78,30.01 28.78,31.08 C10.2 | U3.6 29.18,30.01 28.78,30.01 | MDBT1.24 23.84,14.91 24.06,14.91 | C4.2 12.96,23.11 14.26,24.41 v14.36,24.41 | D5.1 11.14,24.33 10.66,24.81 10.26,24.81 v9.76,25.31 | C12.2 17.56,18.91 17.86,19.21 | C16.2 14.71,18.21 16.66,18.21 | MDBT1.1 26.01,4.66 27.16,5.81 27.16,6.11 27.66,6.61 28.06,6.61 | C14.2 13.26,8.91 10.56,8.91 9.86,8.21 | U$22.22 20.66,32.51 | U$22.10 17.86,27.51 R15.1
  Top 0.254: U3.3 U3.2 U3.1 31.06,27.63 v31.06,27.01 | U1.4 12.26,34.11 C6.2 | J2.S6 5.76,15.91 6.06,16.21 J2.A12 | J2.S1 3.96,23.53 4.98,22.51 J2.S5 5.07,22.64 J2.S3 | J2.S3 | J2.A1 6.47,23 J2.S3 | J2.S6 5.96,15.02 J2.S4 | J2.S6 4.05,14.89 J2.S2 | MDBT1.42 14.84,14.46 14.49,14.81 14.16,14.81 v13.86,15.11
  Bottom 0.2: JMP1.1 12.56,23.11 13.16,23.71 | 15.56,5.01 16.66,3.91 18.66,3.91 19.06,3.51 J3.9 J3.11
  other vias: 33.56,11.51 30.86,5.01 5.76,12.91 3.96,22.31 9.76,29.11 25.26,14.41 17.96,26.11 9.46,7.11 11.16,35.41 14.86,34.21 32.36,30.71
  pour Top: 39.06,39.01 0.06,39.01 0.06,4.51 39.06,4.51
  pour Bottom: 39.06,39.01 0.06,39.01 0.06,4.51 39.06,4.51
  pour Route15: 39.06,4.51 0.06,4.51 0.06,39.01 39.06,39.01
N$1  (via drill 0.35)
  Top 0.254: J2.B8 2.91,19.96 2.67,19.72 v2.56,19.72 | R2.1 3.71,25.41 v2.76,25.41
  Bottom 0.254: v2.56,19.72 1.96,19.72 1.47,20.21 1.47,21.02 3.46,23.01 3.46,24.71 v2.76,25.41
N$2
  Top 0.254: J2.A8 6.96,18.21 7.36,17.81 R4.1
N$4  (via drill 0.35)
  Top 0.254: J2.B5 2.71,18.46 v2.46,18.71 | R26.1 8.56,15.41 v8.36,15.21
  Bottom 0.254: v8.36,15.21 8.36,16.11 6.46,18.01 3.16,18.01 v2.46,18.71
N$5
  Top 0.254: MDBT1.12 25.09,9.39 25.96,8.51 25.96,7.81 26.16,7.61 P21.TP
N$6
  Top 0.254: J2.A5 8.36,20.21 9.46,21.31 R28.1
N$7
  Top 0.254: U8.8 4.83,29.98 R30.2
N$8  (via drill 0.35)
  Top 0.254: J2.B6 5.71,18.96 J2.A6 8.96,19.71 9.06,19.81 v9.16,19.81 9.88,19.81 D3.2 | R31.1 9.86,11.76 9.11,12.51 v8.86,12.51
  Bottom 0.254: v9.16,19.81 9.16,19.51 9.96,18.71 9.96,13.61 v8.86,12.51
N$9  (via drill 0.35)
  Top 0.2: J2.A7 7.47,18.71 v7.56,18.62 7.56,18.81 7.76,19.01
  Top 0.254: D4.2 10.08,19.01 7.76,19.01 | J2.B7 4.01,19.46 v3.76,19.21 | R32.1 10.16,13.16 9.61,13.16 9.16,13.61 v8.86,13.61
  Route2 0.2: 8.46,18.62 v7.56,18.62
  Route2 0.254: 8.46,18.62 9.36,17.72 9.36,14.11 v8.86,13.61
  Bottom 0.254: v7.56,18.62 4.35,18.62 v3.76,19.21
N$18  (via drill 0.35)
  Top 0.2: v17.36,29.91 17.46,29.81 17.46,28.71 | 17.46,28.71 U$22.11 | v23.56,29.01 23.71,28.86 R5.2 | U$22.12 17.3,28.71 17.46,28.71
  Route2 0.2: v17.36,29.91 17.36,30.61 17.56,30.81 21.56,30.81 23.26,29.11 23.56,29.11 v23.56,29.01
N$21
  Top 0.254: 24.86,30.51 T1.C 24.96,28.26 R5.1
N$23
  Top 0.254: T1.B 26.41,33.31 26.41,33.71 26.36,33.76 R1.1 R3.2
N$25  (via drill 0.35)
  Top 0.254: R52.2 11.86,22.91 12.16,23.21 v12.16,24.01 | MDBT1.44 14.29,13.14 14.06,12.91 v13.86,12.91 13.31,13.46 C8.1
  Bottom 0.2: v12.16,24.01 11.66,24.01 10.96,23.31 10.96,18.81 11.56,18.21 12.86,18.21 13.16,17.91 13.16,17.11 12.16,16.11 12.16,14.61 v13.86,12.91
N$26
  Top 0.2: U4.15 14.56,21.51 14.16,21.11 R13.2 14.11,20.16 R6.2
N$28
  Top 0.254: MDBT1.34 18.89,15.24 20.66,17.01 U$19.P$2 20.81,18.46 C15.2
N$29  (via drill 0.35)
  other vias: 22.76,36.41
N$30
  Top 0.254: R19.2 31.46,19.01 D7.3 31.66,17.21 31.36,16.91 29.61,16.91 29.06,16.36 U2.5 28.96,15.36 28.46,15.36 28.01,14.91 C9.1
N$31
  Top 0.254: U2.3 30.26,14.51 R18.1 R20.2
N$32
  Top 0.254: R7.2 30.36,20.66 D7.1
N$33
  Top 0.254: R7.1 R19.1 35.31,22.01 C7.2
N$34
  Top 0.254: MDBT1.36 18.14,15.39 18.31,15.56 U$19.P$1 18.4,17.11 C12.1
N$35
  Top 0.152: MDBT1.25 22.64,14.89 23.06,15.31 25.56,15.31 25.96,14.91 RX.TP
N$36
  Top 0.254: MDBT1.40 16.64,14.94 15.6,15.98 L3.2
N$37  (via drill 0.35)
  Top 0.254: v15.16,23.11 15.29,22.99 U4.13
  Bottom 0.254: JMP1.2 13.76,20.91 15.26,22.41 15.26,23.01 v15.16,23.11
N$38
  Top 0.254: MDBT1.50 11.94,10.89 10.93,9.88 L1.1
N$39
  Top 0.254: MDBT1.52 13.64,10.14 C14.1 12.9,10.21 L1.2
N$40
  Top 0.254: MDBT1.54 14.64,9.39 14.26,9.01 14.26,8.81 13.96,8.51 11.36,8.51 10.93,8.08 L2.1
N$41
  Top 0.254: MDBT1.58 13.64,7.89 C13.1 12.6,7.81 L2.2
N$43
  Top 0.254: Q2.2 15.66,24.16 D8.A
P19
  Top 0.254: MDBT1.14 25.24,10.14 26.26,9.11 P19.TP
QSPI-0  (via drill 0.35)
  Top 0.2: MDBT1.21 22.26,12.66 22.11,12.66 20.96,11.51 v20.66,11.51 | U6.5 26.86,15.92 v26.86,15.41
  Bottom 0.2: v26.86,15.41 26.86,16.11 24.96,18.01 23.36,18.01 22.26,16.91 22.26,12.41 21.36,11.51 v20.66,11.51
QSPI-1  (via drill 0.35)
  Top 0.2: v24.26,20.81 22.79,19.34 U6.2 | MDBT1.27 21.51,13.26 21.06,12.81 v21.06,12.61
  Bottom 0.2: v21.06,12.61 21.76,13.31 21.76,16.91 24.06,19.21 24.06,20.61 v24.26,20.81
QSPI-2  (via drill 0.35)
  Top 0.152: MDBT1.23 22.56,13.71 23.76,13.71 v24.21,14.16
  Top 0.254: U6.3 22.71,18.07 v23.56,17.21
  Bottom 0.254: v23.56,17.21 24.21,16.56 v24.21,14.16
QSPI-3
  Top 0.2: MDBT1.28 21.14,14.69 22.56,16.11 25.66,16.11 26.36,16.81 26.36,17.81 27.74,19.19 U6.7
QSPI-CLK
  Top 0.2: MDBT1.26 21.89,14.74 22.86,15.71 25.96,15.71 26.76,16.51 26.76,17.21 27.62,18.07 U6.6
QSPI-CS  (via drill 0.35)
  Top 0.152: MDBT1.16 24.34,10.89 v24.36,10.91
  Top 0.2: U6.1 22.96,20.61 24.16,21.81 24.75,21.81 v25.16,21.4
  Top 0.254: R22.1 22.19,21.99 U6.1
  Route2 0.2: 23.36,14.41 23.36,11.91 v24.36,10.91
  Route2 0.203: v25.16,21.4 25.16,16.21 23.36,14.41
RESET1  (via drill 0.35)
  Top 0.2: MDBT1.6 25.54,7.14 v26.46,6.21 | P1.TP 29.56,7.61 30.26,8.31 v30.35,8.31 v30.36,8.3
  Bottom 0.2: v30.36,8.3 28.55,8.3 v26.46,6.21
RTC_INT  (via drill 0.35)
  Top 0.152: MDBT1.35 18.51,10.66 18.76,10.41 v18.86,10.41
  Top 0.2: R12.1 30.16,15.81 v29.86,16.11 30.26,15.71 U2.4
  Route2 0.2: v29.86,16.11 29.46,16.11 26.46,13.11 26.46,10.71 25.96,10.21 23.16,10.21 22.56,9.61 19.66,9.61 v18.86,10.41
S_INT  (via drill 0.35)
  Top 0.2: U4.9 17.06,22.69 18.49,24.11 v19.76,24.11
  Route15 0.2: v19.76,24.11 19.66,24.11 18.86,24.91 18.86,26.21 14.46,30.61 14.46,32.01 13.46,33.01 13.46,35.41 14.96,36.91 v14.96,37.01
  Bottom 0.2: v14.96,37.01 14.96,37.07 15.6,37.71 18.06,37.71 18.66,37.11 J4.8
S_SCL  (via drill 0.35)
  Top 0.2: U4.3 16.66,20.43 17.44,19.66 19.21,19.66 19.36,19.51 20.16,19.51 20.36,19.71 v20.66,19.71
  Route15 0.2: v20.66,19.71 21.36,20.41 21.36,27.41 20.56,28.21 17.96,28.21 15.56,30.61 15.56,34.91 16.06,35.41 v16.06,37.01
  Bottom 0.2: J4.6 18.26,36.91 17.86,37.31 16.36,37.31 v16.06,37.01
S_SDA  (via drill 0.35)
  Top 0.2: U4.16 15.29,20.44 v15.06,20.21
  Route15 0.2: v15.06,20.21 16.96,22.11 16.96,25.81 16.16,26.61 13.46,26.61 10.66,29.41 10.66,30.31 13.06,32.71 13.06,36.01 v13.86,36.81
  Bottom 0.152: J4.4 17.86,36.51 17.56,36.81 16.96,36.81
  Bottom 0.2: v13.86,36.81 14.86,35.81 15.96,35.81 16.96,36.81
SBU  (via drill 0.35)
  Top 0.254: R4.2 12.16,17.81 12.46,17.51 v12.46,17.41 | v11.66,25.11 11.96,24.81 12.71,24.81 D8.C | v2.79,26.9 2.83,26.86 R2.2
  Bottom 0.254: v12.46,17.41 11.46,17.41 10.46,18.41 10.46,23.91 v11.66,25.11 10.46,26.31 4.28,26.31 3.69,26.9 v2.79,26.9
SEN_MFIO  (via drill 0.35)
  Top 0.152: 20.99,6.81 20.1,7.69 v20.19,7.78
  Top 0.2: 20.99,6.81 MDBT1.63
  Bottom 0.152: J3.16 20.26,7.71 v20.19,7.78
SEN_MISO  (via drill 0.35)
  Top 0.2: v24.46,12.01 24.16,12.01 23.79,11.64 MDBT1.18
  Bottom 0.2: J3.15 20.26,3.41 20.66,3.81 22.46,3.81 23.56,4.91 23.56,9.01 24.06,9.51 25.26,9.51 26.46,10.71 26.46,11.31 25.86,11.91 24.56,11.91 v24.46,12.01
SEN_MOSI  (via drill 0.35)
  Top 0.2: v20.36,10.31 20.46,10.31 22.16,12.01 MDBT1.19
  Bottom 0.152: J3.8 18.66,4.41 18.86,4.21 22.36,4.21 23.16,5.01 23.16,8.31 21.94,9.54 20.74,9.54 20.36,9.91 v20.36,10.31
SEN_RST  (via drill 0.35)
  Top 0.2: v24.35,8.61 24.33,8.64 MDBT1.10
  Bottom 0.2: J3.19 21.06,3.06 21.3,3.3 22.83,3.38 23.96,4.51 23.96,8.22 v24.35,8.61
SEN_SCK  (via drill 0.35)
  Top 0.152: 20.76,13.31 20.36,12.91 20.36,12.21 19.96,11.81 19.96,11.01 19.56,10.61 19.56,10.11 18.96,9.51 18.86,9.51 18.36,9.01 18.36,6.91 v18.46,6.81
  Top 0.2: MDBT1.29 20.76,13.31
  Bottom 0.152: v18.46,6.81 17.86,6.21 J3.4
SEN_SCL  (via drill 0.35)
  Top 0.152: 22.36,8.36 22.01,8.36 21.49,8.88 v21.42,8.88
  Top 0.2: MDBT1.9 22.36,8.36 | U3.13 29.28,26.53 29.06,26.31 v29.16,26.21 29.26,26.11 RN1.3 | U1.7 13.26,30.61 12.61,29.96 v12.61,29.76
  Top 0.254: 29.28,25.13 RN1.3 | U2.7 28.01,13.46 v27.66,13.11
  Route2 0.2: v21.42,8.88 22.62,8.88 23.55,9.81 26.16,9.81 | v12.61,29.76 12.61,30.66 14.26,32.31 23.36,32.31 27.96,27.71 31.36,27.71 31.76,27.31 31.76,26.31 30.56,25.11 29.76,25.11 29.16,25.71 v29.16,26.21
  Route2 0.203: v27.66,13.11 27.66,12.88 27.08,12.29 27.08,10.73 26.16,9.81
  Bottom 0.152: J3.18 20.66,6.01 20.96,6.31 21.86,6.31 22.26,6.71 22.26,8.71 22.06,8.91 21.45,8.91 v21.42,8.88
  Bottom 0.2: v29.16,26.21 33.46,21.91 33.46,16.71 29.86,13.11 v27.66,13.11
SEN_SDA  (via drill 0.35)
  Top 0.2: v25.16,7.91 25.14,7.89 MDBT1.8 | RN1.2 29.76,25.51 v30.36,26.11 29.78,26.69 U3.14 | U1.8 v13.76,30.01
  Top 0.254: RN1.2 29.78,25.13 | U2.8 28.61,12.11 27.86,12.11 v27.76,12.01
  Route2 0.2: v30.36,26.11 30.36,26.51 29.56,27.31 27.46,27.31 22.86,31.91 15.16,31.91 13.76,30.51 v13.76,30.01
  Bottom 0.152: 13.76,29.98 v13.76,30.01
  Bottom 0.2: J3.17 20.66,2.01 20.96,1.71 22.06,1.71 24.36,4.01 24.36,7.61 24.66,7.91 v25.16,7.91 | v30.36,26.11 33.96,22.51 33.96,16.51 29.46,12.01 v27.76,12.01
  Bottom 0.254: v27.76,12.01 27.76,9.31 26.36,7.91 v25.16,7.91
SW1  (via drill 0.35)
  Top 0.152: MDBT1.39 17.01,13.46 17.76,12.71 17.76,11.61 v17.46,11.31
  Top 0.2: MDBT1.39 17.11,13.41 | 31.85,11.52 31.86,11.51 v31.86,10.61 31.85,10.6 U$24.2
  Top 0.254: R10.2 31.85,11.52
  Route2 0.2: v31.86,10.61 30.46,10.61 27.06,7.21 22.66,7.21 20.76,5.31 15.06,5.31 14.66,5.71 14.66,8.61 17.36,11.31 v17.46,11.31
SW3  (via drill 0.35)
  Top 0.2: MDBT1.30 20.39,15.14 v20.66,15.41 20.66,15.31
  Top 0.254: U$17.2 35.02,24.11 R8.2 32.96,23.51 32.26,22.81 29.69,22.81 v29.67,22.8
  Bottom 0.254: v29.67,22.8 29.26,23.21 24.16,23.21 23.46,22.51 23.46,19.21 20.66,16.41 v20.66,15.41
SW_D1  (via drill 0.35)
  Top 0.2: U4.2 16.26,20.34 16.86,19.74 16.86,19.01 16.56,18.71 15.46,18.71 15.26,18.91 v15.16,18.91 14.96,19.11 D11.2
  Top 0.254: J2.B2 3.91,16.96 v3.66,16.71 | v8.06,22.71 7.96,22.71 6.96,21.71 J2.A2
  Route2 0.2: v3.66,16.71 5.06,18.11 5.06,20.41 7.36,22.71 v8.06,22.71 9.06,22.71 12.06,19.71 14.36,19.71 v15.16,18.91
SW_D2  (via drill 0.35)
  Top 0.2: U4.5 18.16,21.11 v18.56,20.71
  Top 0.254: J2.B3 1.61,17.46 v1.46,17.31 | v7.06,13.61 7.86,14.41 9.98,14.41 D1.2 | J2.A3 7.56,21.21 v7.96,21.61
  Route2 0.254: v7.96,21.61 9.16,21.61 11.46,19.31 13.36,19.31 14.56,18.11 16.76,18.11 18.56,19.91 v18.56,20.71
  Bottom 0.254: v1.46,17.31 1.86,17.31 3.96,15.21 3.96,14.21 4.46,13.71 6.96,13.71 v7.06,13.61 7.86,14.41 8.66,14.41 9.26,15.01 9.26,18.61 7.96,19.91 v7.96,21.61
SW_D3  (via drill 0.35)
  Top 0.2: U4.7 18.36,21.91 v18.66,22.21
  Top 0.254: J2.A11 7.06,16.71 7.46,16.31 v7.46,15.91 7.66,16.11 8.88,16.11 9.38,16.61 D6.2 | J2.B11 3.61,21.46 3.06,22.01 v1.36,22.01
  Route2 0.2: v18.66,22.21 18.36,22.51 18.36,24.71 16.36,26.71 6.66,26.71 1.96,22.01 v1.36,22.01
  Bottom 0.254: v1.36,22.01 0.96,21.61 0.96,19.11 2.56,17.51 6.16,17.51 7.46,16.21 v7.46,15.91
SW_D4  (via drill 0.35)
  Top 0.2: U4.10 16.66,22.91 17.66,23.91 v17.66,24.31
  Top 0.254: J2.B10 3.01,20.96 v2.76,21.21 | D5.2 9.88,24.11 v8.86,24.11 | v8.46,17.01 8.26,17.21 J2.A10
  Route2 0.2: v17.66,24.31 17.66,24.91 16.26,26.31 9.76,26.31 8.86,25.41 v8.86,24.11
  Bottom 0.254: v2.76,21.21 3.06,20.91 5.36,20.91 5.86,21.41 | v8.86,24.11 8.26,24.11 5.71,21.56 5.86,21.41 | v8.46,17.01 8.56,17.11 8.56,18.71 5.86,21.41
SWCLK1  (via drill 0.35)
  Top 0.2: MDBT1.2 24.24,5.64 24.5,5.37 v25.23,5.37 | U4.4 17.06,20.61 17.66,20.01 19.36,20.01 v19.66,20.31
  Top 0.254: v6.26,9.81 6.76,10.31 7.66,10.31 8.25,10.9 J1.3
  Route2 0.254: v25.23,5.37 23.57,3.71 14.26,3.71 9.36,8.61 6.96,8.61 6.26,9.31 v6.26,9.81 7.96,11.51 8.96,11.51 10.56,13.11 10.56,17.81 11.56,18.81 13.06,18.81 14.26,17.61 16.96,17.61 v19.66,20.31
SWDIO1  (via drill 0.35)
  Top 0.2: v25.13,6.4 25.11,6.39 MDBT1.4 | U4.1 15.86,20.01 16.06,19.81 16.06,19.41 v16.16,19.41
  Top 0.254: v7.36,9.41 8.25,9.41 J1.4
  Route2 0.254: v25.13,6.4 24.65,6.4 22.46,4.21 14.36,4.21 9.36,9.21 7.56,9.21 v7.36,9.41
  Route15 0.254: v7.36,9.41 12.56,9.41 16.16,13.01 v16.16,19.41
TFT_BL  (via drill 0.35)
  Top 0.152: MDBT1.22 24.64,13.14 v24.66,13.11
  Top 0.2: v24.36,34.51 25.11,34.51 R1.2
  Route2 0.2: v24.66,13.11 25.76,13.11 29.06,16.41 29.06,17.81 33.46,22.21 33.46,27.01 28.86,31.61 27.26,31.61 v24.36,34.51
TFT_CS  (via drill 0.35)
  Top 0.152: 22.26,9.01 21.66,9.61 19.76,9.61 19.06,8.91 v19.06,8.71
  Top 0.2: MDBT1.11 22.26,9.01 | U$22.4 20.26,27.81 v19.56,27.11
  Route15 0.152: v19.56,27.11 19.56,26.71 20.46,25.81 20.46,22.81 19.16,21.51 18.16,21.51 17.56,20.91 17.56,14.01 18.16,13.41 18.16,9.81 19.06,8.91 v19.06,8.71
TFT_DC  (via drill 0.35)
  Top 0.152: MDBT1.43 15.96,13.71 14.56,13.71 v14.26,14.01
  Top 0.2: U$22.8 18.66,29.31 18.46,29.51 v18.46,29.91
  Route2 0.2: v14.26,14.01 16.56,16.31 19.86,16.31 22.56,19.01 22.56,26.41 20.76,28.21 19.36,28.21 18.46,29.11 v18.46,29.91
TFT_MOSI  (via drill 0.35)
  Top 0.152: MDBT1.51 16.46,10.51 16.76,10.21 16.76,9.01 17.44,8.33 v17.44,7.99
  Top 0.2: MDBT1.51 16.26,10.51 | U$22.7 19.06,29.31 19.56,29.81 v19.56,29.91
  Bottom 0.2: v17.44,7.99 16.78,7.99 15.46,9.31 15.46,12.91 22.26,19.71 22.26,27.21 v19.56,29.91
TFT_RST  (via drill 0.35)
  Top 0.2: U$22.3 v20.66,26.71
  Top 0.254: MDBT1.65 18.69,5.81 16.96,5.81 v16.46,6.31
  Bottom 0.2: v16.46,6.31 15.06,7.71 15.06,13.11 21.86,19.91 21.86,24.11 20.76,25.21 20.76,26.61 v20.66,26.71
TFT_SCK  (via drill 0.35)
  Top 0.2: MDBT1.47 16.36,12.01 16.76,11.61 16.76,10.88 v17.43,10.21 | U$22.5 19.86,29.11 20.56,29.81 v20.76,29.81
  Bottom 0.2: v17.43,10.21 16.77,10.21 15.86,11.11 15.86,12.81 22.66,19.61 22.66,27.31 20.76,29.21 v20.76,29.81
TP_INT  (via drill 0.35)
  Top 0.152: 22.26,7.51 21.56,8.21 20.86,8.21 v20.16,8.91
  Top 0.2: MDBT1.7 22.26,7.51 | U$22.16 18.26,32.91 17.36,33.81 v17.36,34.11
  Route15 0.2: v17.36,34.11 18.96,35.71 22.36,35.71 23.26,34.81 23.26,34.51 26.16,31.61 26.16,31.11 27.06,30.21 27.06,18.61 22.96,14.51
  Route15 0.203: 22.96,14.51 22.36,13.91 22.36,10.21 arc-90 21.76,9.61 20.86,9.61 arc90 v20.16,8.91
TP_RST  (via drill 0.35)
  Top 0.152: MDBT1.5 22.31,6.76 21.76,7.31 21.66,7.31
  Top 0.2: 21.66,7.31 21.46,7.31 v21.26,7.51 | U$22.19 19.46,32.51 20.01,33.06 20.21,33.06 20.56,33.41 21.96,33.41 23.46,34.91 v23.46,35.61
  Route15 0.2: 23.46,14.41 27.46,18.41 27.46,30.41 26.86,31.01 26.86,34.81 26.36,35.31 23.76,35.31 v23.46,35.61
  Route15 0.203: 23.46,14.41 22.86,13.81 22.86,9.01 21.36,7.51 v21.26,7.51
TP_SCL  (via drill 0.35)
  Top 0.152: MDBT1.31 20.01,12.36 19.26,11.61 v19.26,11.41
  Top 0.2: U$22.17 18.66,32.91 19.56,33.81 R9.2 18.76,34.11 v18.56,34.31
  Route15 0.2: v19.26,11.41 20.16,12.31 20.16,12.81 20.86,13.51 21.36,13.51 26.66,18.81 26.66,29.91 25.66,30.91 25.66,31.41 22.76,34.31 22.76,34.51 21.96,35.31 19.56,35.31 v18.56,34.31
TP_SDA  (via drill 0.35)
  Top 0.2: MDBT1.33 v19.26,12.61 | U$22.18 19.06,32.71 19.76,33.41 20.06,33.41 20.56,33.91 R11.2 20.86,34.41 v21.56,34.41
  Route15 0.2: v19.26,12.61 20.66,14.01 21.36,14.01 26.26,18.91 26.26,29.61 25.16,30.71 25.16,31.31 22.06,34.41 v21.56,34.41
UART_TX  (via drill 0.35)
  Top 0.2: J1.2 7.86,11.81 8.86,11.81 9.96,10.71 v10.06,10.71 | U4.8 17.69,22.74 18.16,23.21 v19.16,23.21
  Top 0.254: TX.TP 25.96,10.71 v25.66,11.01 | MDBT1.13 22.11,9.76 21.56,10.31 v21.46,10.31
  Route2 0.2: v21.46,10.31 22.56,11.41 22.56,12.91 21.76,13.71 17.36,13.71 15.06,11.41 10.76,11.41 | 10.76,11.41 v10.06,10.71 | 10.76,11.41 10.56,11.41 11.66,12.51 11.66,15.71 12.66,16.71 19.66,16.71 21.76,18.81 21.76,20.61 v19.16,23.21
  Bottom 0.254: v25.66,11.01 24.76,10.11 21.66,10.11 v21.46,10.31
USB_D+
  Top 0.254: MDBT1.46 14.81,12.39 14.61,12.19 12.74,12.19 11.86,13.06 R32.2
USB_D-
  Top 0.254: R31.2 11.99,11.64 MDBT1.48
VBAT  (via drill 0.35)
  Top 0.254: D2.C 8.11,25.71 Q1.2 9.02,27.81 C3.1 10.13,28.33 U9.3 10.71,27.76 11.16,27.31 12.26,27.31 12.61,27.66 U9.1 13.18,28.33 v13.66,28.81
  Route2 0.2: v23.46,30.11 23.26,30.11 21.81,31.56 16.11,31.56 15.16,30.61 15.16,30.41 13.66,28.91 v13.66,28.81
  Bottom 0.2: J4.5 18.26,32.31 18.66,31.91 21.96,31.91 23.46,30.41 v23.46,30.11
  Bottom 0.254: 13.66,28.91 v13.66,28.81
VPP  (via drill 0.35)
  Top 0.2: v19.64,25.37 19.39,25.11 Q2.3
  Route15 0.2: v14.86,33.11 14.86,30.71 19.66,25.91 19.66,25.39 v19.64,25.37
  Bottom 0.2: v14.86,33.11 15.56,33.11 16.56,32.11 17.16,32.11 17.46,32.41 J4.1 J4.3
VUSB2  (via drill 0.35)
  Top 0.2: R6.1 12.01,22.11 10.46,22.11 10.06,22.51 10.06,22.61 | U8.2 9.24,30.48 C5.1 9.58,29.98 U8.1
  Top 0.254: D2.A 6.21,25.51 Q1.1 6.65,26.9 8.72,28.97 v8.72,29.11 U8.1 | R29.2 6.01,25.51 D2.A | Q2.1 16.66,26.26 R15.2 16.46,27.51 v15.56,27.51 | J2.A9 5.86,17.71 5.61,17.96 J2.B4 2.11,17.96 1.66,18.41 1.66,20.01 2.11,20.46 J2.B9 5.61,20.46 5.86,20.71 J2.A4 8.16,20.71 10.06,22.61 R52.1 9.26,22.91 9.15,23.02 8.85,23.02 6.46,25.41 D2.A
  Bottom 0.254: v15.56,27.51 10.26,27.51 8.72,29.06 v8.72,29.11

### Text on the board
tPlace: GND | B- | B+ | protocentral.com | RX | TX | GND | P19 | 3V3 | RST | P21 | GND | 02/24 | v3
bPlace: MUX_SEL | EN | DIS | pc_healthypi_move | v3 | 03/24 | protocentral.com